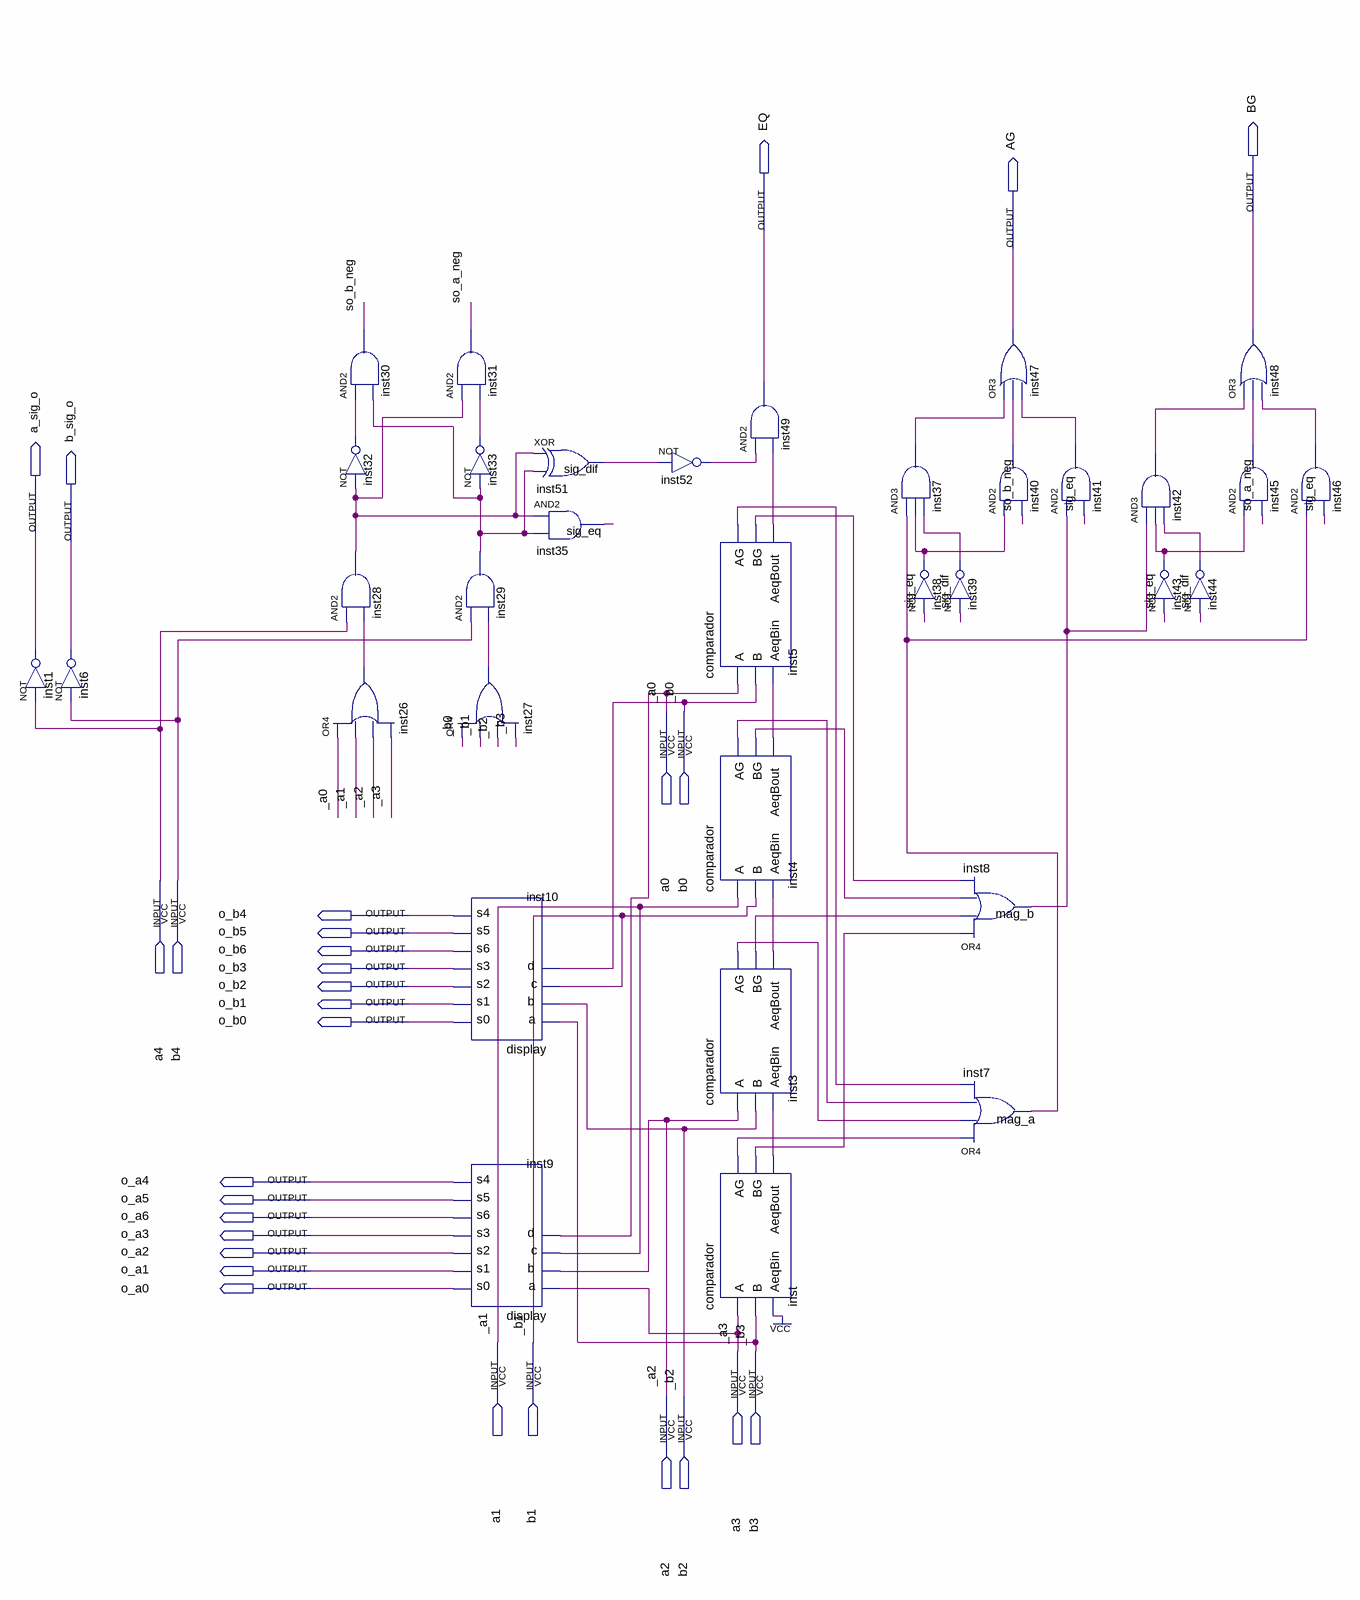
[diagram p0: schematic sheet]
// Quartus schematic aula13.bdf as structural Verilog: 34 symbols, 29 pins
module aula13 (
  input  a0,
  input  b0,
  input  a4,
  input  b4,
  input  a1,
  input  b1,
  input  a3,
  input  b3,
  input  a2,
  input  b2,
  output BG,
  output EQ,
  output AG,
  output a_sig_o,
  output b_sig_o,
  output o_b4,
  output o_b5,
  output o_b6,
  output o_b3,
  output o_b2,
  output o_b1,
  output o_b0,
  output o_a4,
  output o_a5,
  output o_a6,
  output o_a3,
  output o_a2,
  output o_a1,
  output o_a0
);

  wire inst3_aeqbout, inst3_ag, inst3_bg, inst4_aeqbout, inst4_ag, inst4_bg, inst5_aeqbout, inst5_ag,
       inst5_bg, inst26_out, inst27_out, inst28_out, inst29_out, inst32_out, inst33_out, inst37_out,
       inst38_out, inst39_out, inst40_out, inst41_out, inst42_out, inst43_out, inst44_out, inst45_out,
       inst46_out, inst52_out, inst_aeqbout, inst_ag, inst_bg, mag_a, mag_b, sig_dif, sig_eq, so_a_neg,
       so_b_neg;

  not inst1 (a_sig_o, a4);
  not inst6 (b_sig_o, b4);
  and inst30 (so_b_neg, inst32_out, inst29_out);
  not inst32 (inst32_out, inst28_out);
  and inst28 (inst28_out, a4, inst26_out);
  or inst26 (inst26_out, a0, a1, a2, a3);
  and inst31 (so_a_neg, inst28_out, inst33_out);
  not inst33 (inst33_out, inst29_out);
  and inst29 (inst29_out, b4, inst27_out);
  or inst27 (inst27_out, b0, b1, b2, b3);
  display inst10 (
    .a(b3), .b(b2), .c(b1), .d(b0), .s0(o_b0), .s1(o_b1), .s2(o_b2), .s3(o_b3), .s6(o_b6), .s5(o_b5),
    .s4(o_b4));
  display inst9 (
    .a(a3), .b(a2), .c(a1), .d(a0), .s0(o_a0), .s1(o_a1), .s2(o_a2), .s3(o_a3), .s6(o_a6), .s5(o_a5),
    .s4(o_a4));
  xor inst51 (sig_dif, inst28_out, inst29_out);
  and inst35 (sig_eq, inst28_out, inst29_out);
  not inst52 (inst52_out, sig_dif);
  comparador inst5 (.A(a0), .B(b0), .AeqBin(inst4_aeqbout), .AG(inst5_ag), .BG(inst5_bg), .AeqBout(inst5_aeqbout));
  comparador inst4 (.A(a1), .B(b1), .AeqBin(inst3_aeqbout), .AG(inst4_ag), .BG(inst4_bg), .AeqBout(inst4_aeqbout));
  comparador inst3 (.A(a2), .B(b2), .AeqBin(inst_aeqbout), .AG(inst3_ag), .BG(inst3_bg), .AeqBout(inst3_aeqbout));
  comparador inst (.A(a3), .B(b3), .AeqBin(1'b1), .AG(inst_ag), .BG(inst_bg), .AeqBout(inst_aeqbout));
  and inst49 (EQ, inst52_out, inst5_aeqbout);
  and inst37 (inst37_out, mag_a, inst38_out, inst39_out);
  not inst38 (inst38_out, sig_eq);
  or inst47 (AG, inst37_out, inst40_out, inst41_out);
  and inst40 (inst40_out, inst38_out, so_b_neg);
  not inst39 (inst39_out, sig_dif);
  or inst8 (mag_b, inst_bg, inst3_bg, inst4_bg, inst5_bg);
  or inst7 (mag_a, inst_ag, inst3_ag, inst4_ag, inst5_ag);
  and inst41 (inst41_out, mag_b, sig_eq);
  and inst42 (inst42_out, mag_b, inst43_out, inst44_out);
  not inst43 (inst43_out, sig_eq);
  not inst44 (inst44_out, sig_dif);
  or inst48 (BG, inst42_out, inst45_out, inst46_out);
  and inst45 (inst45_out, inst43_out, so_a_neg);
  and inst46 (inst46_out, mag_a, sig_eq);

  // Other names for the same wires on the sheet: _a0 = a0; _a1 = a1; _a2 = a2; _a3 = a3; _b0 = b0; _b1 = b1; _b2 = b2;
  //   _b3 = b3
endmodule
